# Altium schematic sheet HI_CURRENT.SchDoc: MoonPilot - Hi Current Out
size A3; DrawnBy: Máni Magnússon; Revision: A
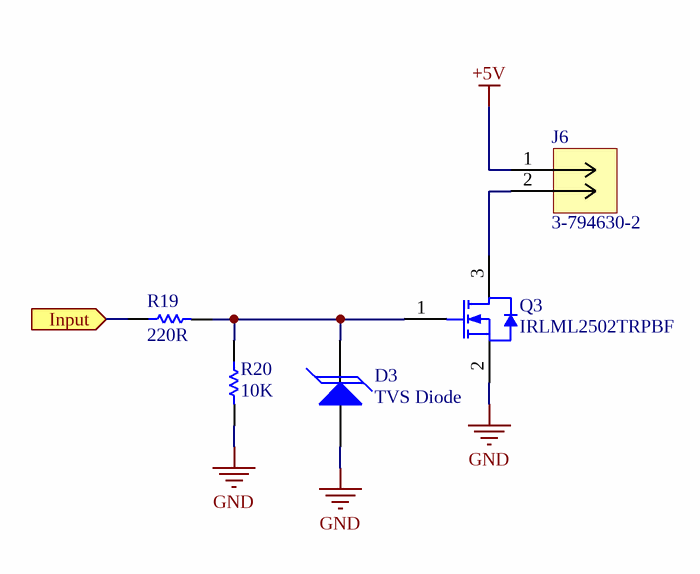
[diagram p0: HI_CURRENT.SchDoc]

## Parts
D3  TVS Diode  [SOD-123]
J6  3-794630-2  [3-794630-2]
Q3  IRLML2502TRPBF  [INTR-SOT-23-3_V]
R19  220R  [0603_RES]
R20  10K  [0603_RES]

## Ports
Input (in)

## Nets
+5V: J6.1
GND: D3.2(A) Q3.2(S) R20.2
Input: R19.1 ; port Input
NetD3_1: D3.1(K) Q3.1(G) R19.2 R20.1
NetJ6_2: J6.2 Q3.3(D)

## Notes on the sheet
- Sheet title:
- Revision:
- Drawn by:
- Date:
- File:

## Library data of the parts
D3 = TVS Diode: PTVS3V3S1UR,115 / Digikey part no. 1727-5228-1-ND
J6 = 2 pin vertical molex: Digikey part no. A33219-ND; Vendor: TE Connectivity; Built_By: EMA_UL_Team; SourceLibrary: Tyco_2012-04-26; Manufacturer_Part_Number: 3-794630-2; Copyright: Copyright (C) 2018 Accelerated Designs. All rights reserved; RefDes: RefDes; Type: DEV
Q3 = IRLML2502TRPBF: N-Channel HEXFET(R) Power MOSFET, 20 V VDS, +/- 12 V VGS, 4.2 A, 3-Pin SOT23, RoHS, Tape and Reel; Manufacturer: International Rectifier; Drain-to-Source Voltage [Vdss]: 20V; Drain-Source On Resistance-Max: 0.045O; Qg Gate Charge: 8nC; Rated Power Dissipation: 1.25W; Package Reference: SOT-23-3; Manufacturer URL: http://internationalrectifier.com/; Package Description: 3-Pin Small Outline Transistor, Body 2.92 x 1.3 mm, Pitch 0.95 mm; Datasheet Version: Apr-14; Channel Type: N-Channel; Datasheet URL: https://datasheet.ciiva.com/6383/irlml2502pbf-6383216.pdf
R19 R20 = Resistor